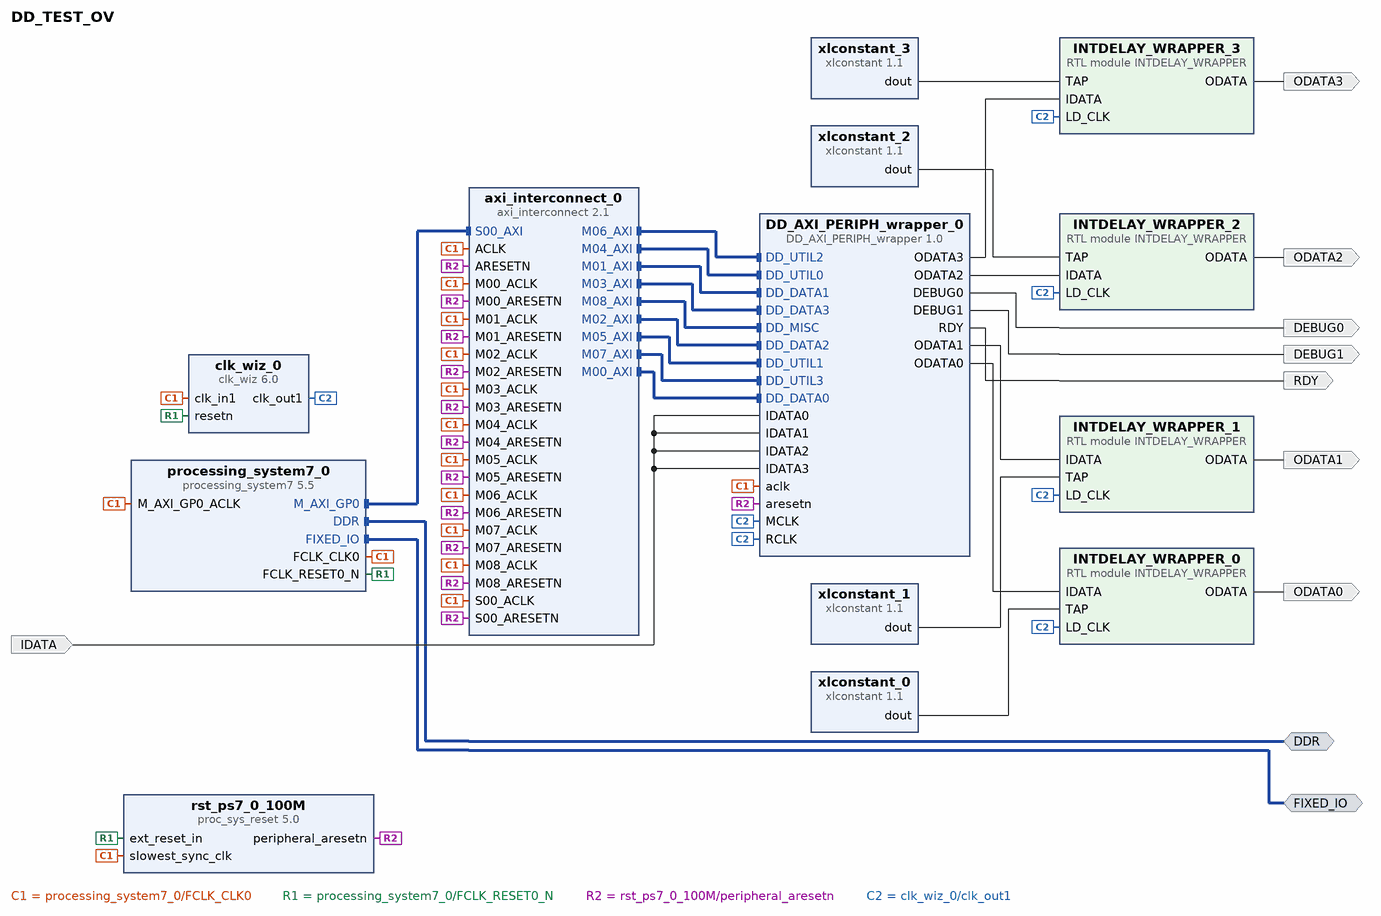
[diagram p0: block diagram of the top level]
# Vivado block design DD_TEST_OV, xc7z020clg400-1, Vivado 2019.1
create_bd_design DD_TEST_OV

create_bd_intf_port -mode Master -vlnv xilinx.com:interface:ddrx_rtl:1.0 DDR
create_bd_intf_port -mode Master -vlnv xilinx.com:display_processing_system7:fixedio_rtl:1.0 FIXED_IO
create_bd_port -dir O ODATA0
create_bd_port -dir O ODATA1
create_bd_port -dir O RDY
create_bd_port -dir I -type data IDATA
create_bd_port -dir O DEBUG0
create_bd_port -dir O DEBUG1
create_bd_port -dir O ODATA2
create_bd_port -dir O ODATA3

create_bd_cell -type ip -vlnv xilinx.com:ip:processing_system7:5.5 processing_system7_0
set_property -dict [list \
  CONFIG.PCW_APU_PERIPHERAL_FREQMHZ 650 \
  CONFIG.PCW_CRYSTAL_PERIPHERAL_FREQMHZ 50 \
  CONFIG.PCW_ENET0_ENET0_IO {MIO 16 .. 27} \
  CONFIG.PCW_ENET0_GRP_MDIO_ENABLE 1 \
  CONFIG.PCW_ENET0_GRP_MDIO_IO {MIO 52 .. 53} \
  CONFIG.PCW_ENET0_PERIPHERAL_ENABLE 1 \
  CONFIG.PCW_ENET0_RESET_ENABLE 1 \
  CONFIG.PCW_ENET0_RESET_IO {MIO 9} \
  CONFIG.PCW_ENET_RESET_ENABLE 1 \
  CONFIG.PCW_ENET_RESET_SELECT {Share reset pin} \
  CONFIG.PCW_FPGA0_PERIPHERAL_FREQMHZ 100 \
  CONFIG.PCW_FPGA1_PERIPHERAL_FREQMHZ 50 \
  CONFIG.PCW_GPIO_MIO_GPIO_ENABLE 1 \
  CONFIG.PCW_GPIO_MIO_GPIO_IO MIO \
  CONFIG.PCW_I2C_RESET_ENABLE 1 \
  CONFIG.PCW_M_AXI_GP0_FREQMHZ 10 \
  CONFIG.PCW_PERIPHERAL_BOARD_PRESET None \
  CONFIG.PCW_PRESET_BANK1_VOLTAGE {LVCMOS 1.8V} \
  CONFIG.PCW_QSPI_GRP_FBCLK_ENABLE 1 \
  CONFIG.PCW_QSPI_GRP_FBCLK_IO {MIO 8} \
  CONFIG.PCW_QSPI_GRP_SINGLE_SS_ENABLE 1 \
  CONFIG.PCW_QSPI_GRP_SINGLE_SS_IO {MIO 1 .. 6} \
  CONFIG.PCW_QSPI_PERIPHERAL_ENABLE 1 \
  CONFIG.PCW_QSPI_QSPI_IO {MIO 1 .. 6} \
  CONFIG.PCW_SD0_GRP_CD_ENABLE 1 \
  CONFIG.PCW_SD0_GRP_CD_IO {MIO 47} \
  CONFIG.PCW_SD0_GRP_WP_ENABLE 0 \
  CONFIG.PCW_SD0_PERIPHERAL_ENABLE 1 \
  CONFIG.PCW_SD0_SD0_IO {MIO 40 .. 45} \
  CONFIG.PCW_SDIO_PERIPHERAL_FREQMHZ 50 \
  CONFIG.PCW_SINGLE_QSPI_DATA_MODE x4 \
  CONFIG.PCW_UART0_PERIPHERAL_ENABLE 1 \
  CONFIG.PCW_UART0_UART0_IO {MIO 14 .. 15} \
  CONFIG.PCW_UART1_PERIPHERAL_ENABLE 0 \
  CONFIG.PCW_UART_PERIPHERAL_FREQMHZ 100 \
  CONFIG.PCW_UIPARAM_DDR_BUS_WIDTH {16 Bit} \
  CONFIG.PCW_UIPARAM_DDR_FREQ_MHZ 525 \
  CONFIG.PCW_UIPARAM_DDR_PARTNO {MT41J256M16 RE-125} \
  CONFIG.PCW_USB0_PERIPHERAL_ENABLE 1 \
  CONFIG.PCW_USB0_RESET_ENABLE 1 \
  CONFIG.PCW_USB0_RESET_IO {MIO 46} \
  CONFIG.PCW_USB0_USB0_IO {MIO 28 .. 39} \
  CONFIG.PCW_USB_RESET_ENABLE 1 \
  CONFIG.PCW_USB_RESET_SELECT {Share reset pin} \
] [get_bd_cells processing_system7_0]
# 481 more settings of processing_system7_0 are not shown: defaults, MIO pin electricals, DDR timing, and values the tool derives
create_bd_cell -type ip -vlnv xilinx.com:ip:axi_interconnect:2.1 axi_interconnect_0
set_property -dict {CONFIG.NUM_MI 9} [get_bd_cells axi_interconnect_0]
create_bd_cell -type ip -vlnv xilinx.com:ip:proc_sys_reset:5.0 rst_ps7_0_100M
create_bd_cell -type ip -vlnv cri.nz:user:DD_AXI_PERIPH_wrapper:1.0 DD_AXI_PERIPH_wrapper_0
create_bd_cell -type ip -vlnv xilinx.com:ip:clk_wiz:6.0 clk_wiz_0
set_property -dict [list \
  CONFIG.CLKOUT1_JITTER 96.239 \
  CONFIG.CLKOUT1_PHASE_ERROR 88.872 \
  CONFIG.CLKOUT1_REQUESTED_OUT_FREQ 310.000 \
  CONFIG.JITTER_SEL Min_O_Jitter \
  CONFIG.MMCM_BANDWIDTH HIGH \
  CONFIG.MMCM_CLKFBOUT_MULT_F 11.625 \
  CONFIG.MMCM_CLKOUT0_DIVIDE_F 3.750 \
  CONFIG.PRIM_IN_FREQ 100.000 \
  CONFIG.RESET_PORT resetn \
  CONFIG.RESET_TYPE ACTIVE_LOW \
  CONFIG.USE_LOCKED false \
] [get_bd_cells clk_wiz_0]
create_bd_cell -type module -reference INTDELAY_WRAPPER INTDELAY_WRAPPER_0
create_bd_cell -type module -reference INTDELAY_WRAPPER INTDELAY_WRAPPER_1
create_bd_cell -type module -reference INTDELAY_WRAPPER INTDELAY_WRAPPER_2
create_bd_cell -type module -reference INTDELAY_WRAPPER INTDELAY_WRAPPER_3
create_bd_cell -type ip -vlnv xilinx.com:ip:xlconstant:1.1 xlconstant_0
set_property -dict {CONFIG.CONST_VAL 1 CONFIG.CONST_WIDTH 5} [get_bd_cells xlconstant_0]
create_bd_cell -type ip -vlnv xilinx.com:ip:xlconstant:1.1 xlconstant_1
set_property -dict {CONFIG.CONST_VAL 0 CONFIG.CONST_WIDTH 5} [get_bd_cells xlconstant_1]
create_bd_cell -type ip -vlnv xilinx.com:ip:xlconstant:1.1 xlconstant_2
set_property -dict {CONFIG.CONST_VAL 19 CONFIG.CONST_WIDTH 5} [get_bd_cells xlconstant_2]
create_bd_cell -type ip -vlnv xilinx.com:ip:xlconstant:1.1 xlconstant_3
set_property -dict {CONFIG.CONST_VAL 0 CONFIG.CONST_WIDTH 5} [get_bd_cells xlconstant_3]

# ---- connections ----

connect_bd_intf_net [get_bd_intf_pins axi_interconnect_0/M06_AXI] [get_bd_intf_pins DD_AXI_PERIPH_wrapper_0/DD_UTIL2]
connect_bd_intf_net [get_bd_intf_pins axi_interconnect_0/M04_AXI] [get_bd_intf_pins DD_AXI_PERIPH_wrapper_0/DD_UTIL0]
connect_bd_intf_net [get_bd_intf_ports DDR] [get_bd_intf_pins processing_system7_0/DDR]
connect_bd_intf_net [get_bd_intf_pins DD_AXI_PERIPH_wrapper_0/DD_DATA1] [get_bd_intf_pins axi_interconnect_0/M01_AXI]
connect_bd_intf_net [get_bd_intf_ports FIXED_IO] [get_bd_intf_pins processing_system7_0/FIXED_IO]
connect_bd_intf_net [get_bd_intf_pins axi_interconnect_0/M03_AXI] [get_bd_intf_pins DD_AXI_PERIPH_wrapper_0/DD_DATA3]
connect_bd_intf_net [get_bd_intf_pins axi_interconnect_0/M08_AXI] [get_bd_intf_pins DD_AXI_PERIPH_wrapper_0/DD_MISC]
connect_bd_intf_net [get_bd_intf_pins axi_interconnect_0/M02_AXI] [get_bd_intf_pins DD_AXI_PERIPH_wrapper_0/DD_DATA2]
connect_bd_intf_net [get_bd_intf_pins axi_interconnect_0/M05_AXI] [get_bd_intf_pins DD_AXI_PERIPH_wrapper_0/DD_UTIL1]
connect_bd_intf_net [get_bd_intf_pins axi_interconnect_0/S00_AXI] [get_bd_intf_pins processing_system7_0/M_AXI_GP0]
connect_bd_intf_net [get_bd_intf_pins axi_interconnect_0/M07_AXI] [get_bd_intf_pins DD_AXI_PERIPH_wrapper_0/DD_UTIL3]
connect_bd_intf_net [get_bd_intf_pins DD_AXI_PERIPH_wrapper_0/DD_DATA0] [get_bd_intf_pins axi_interconnect_0/M00_AXI]
connect_bd_net [get_bd_pins processing_system7_0/FCLK_CLK0] \
  [get_bd_pins axi_interconnect_0/ACLK] [get_bd_pins rst_ps7_0_100M/slowest_sync_clk] \
  [get_bd_pins axi_interconnect_0/M00_ACLK] [get_bd_pins axi_interconnect_0/M01_ACLK] \
  [get_bd_pins axi_interconnect_0/S00_ACLK] [get_bd_pins processing_system7_0/M_AXI_GP0_ACLK] \
  [get_bd_pins axi_interconnect_0/M02_ACLK] [get_bd_pins axi_interconnect_0/M03_ACLK] \
  [get_bd_pins axi_interconnect_0/M04_ACLK] [get_bd_pins axi_interconnect_0/M05_ACLK] \
  [get_bd_pins DD_AXI_PERIPH_wrapper_0/aclk] [get_bd_pins axi_interconnect_0/M06_ACLK] \
  [get_bd_pins axi_interconnect_0/M07_ACLK] [get_bd_pins axi_interconnect_0/M08_ACLK] [get_bd_pins clk_wiz_0/clk_in1]
connect_bd_net [get_bd_pins processing_system7_0/FCLK_RESET0_N] [get_bd_pins rst_ps7_0_100M/ext_reset_in] [get_bd_pins clk_wiz_0/resetn]
connect_bd_net [get_bd_pins rst_ps7_0_100M/peripheral_aresetn] \
  [get_bd_pins axi_interconnect_0/ARESETN] [get_bd_pins axi_interconnect_0/M00_ARESETN] \
  [get_bd_pins axi_interconnect_0/M01_ARESETN] [get_bd_pins axi_interconnect_0/S00_ARESETN] \
  [get_bd_pins axi_interconnect_0/M02_ARESETN] [get_bd_pins axi_interconnect_0/M03_ARESETN] \
  [get_bd_pins axi_interconnect_0/M04_ARESETN] [get_bd_pins axi_interconnect_0/M05_ARESETN] \
  [get_bd_pins DD_AXI_PERIPH_wrapper_0/aresetn] [get_bd_pins axi_interconnect_0/M06_ARESETN] \
  [get_bd_pins axi_interconnect_0/M07_ARESETN] [get_bd_pins axi_interconnect_0/M08_ARESETN]
connect_bd_net [get_bd_ports IDATA] \
  [get_bd_pins DD_AXI_PERIPH_wrapper_0/IDATA0] [get_bd_pins DD_AXI_PERIPH_wrapper_0/IDATA1] \
  [get_bd_pins DD_AXI_PERIPH_wrapper_0/IDATA2] [get_bd_pins DD_AXI_PERIPH_wrapper_0/IDATA3]
connect_bd_net -net clk_wiz_1_clk_out1 [get_bd_pins clk_wiz_0/clk_out1] \
  [get_bd_pins DD_AXI_PERIPH_wrapper_0/RCLK] [get_bd_pins DD_AXI_PERIPH_wrapper_0/MCLK] \
  [get_bd_pins INTDELAY_WRAPPER_0/LD_CLK] [get_bd_pins INTDELAY_WRAPPER_1/LD_CLK] [get_bd_pins INTDELAY_WRAPPER_2/LD_CLK] \
  [get_bd_pins INTDELAY_WRAPPER_3/LD_CLK]
connect_bd_net [get_bd_pins DD_AXI_PERIPH_wrapper_0/RDY] [get_bd_ports RDY]
connect_bd_net [get_bd_pins DD_AXI_PERIPH_wrapper_0/DEBUG0] [get_bd_ports DEBUG0]
connect_bd_net [get_bd_pins DD_AXI_PERIPH_wrapper_0/DEBUG1] [get_bd_ports DEBUG1]
connect_bd_net [get_bd_pins INTDELAY_WRAPPER_0/ODATA] [get_bd_ports ODATA0]
connect_bd_net [get_bd_pins INTDELAY_WRAPPER_1/ODATA] [get_bd_ports ODATA1]
connect_bd_net [get_bd_pins INTDELAY_WRAPPER_2/ODATA] [get_bd_ports ODATA2]
connect_bd_net [get_bd_pins INTDELAY_WRAPPER_3/ODATA] [get_bd_ports ODATA3]
connect_bd_net [get_bd_pins DD_AXI_PERIPH_wrapper_0/ODATA0] [get_bd_pins INTDELAY_WRAPPER_0/IDATA]
connect_bd_net [get_bd_pins DD_AXI_PERIPH_wrapper_0/ODATA1] [get_bd_pins INTDELAY_WRAPPER_1/IDATA]
connect_bd_net [get_bd_pins DD_AXI_PERIPH_wrapper_0/ODATA2] [get_bd_pins INTDELAY_WRAPPER_2/IDATA]
connect_bd_net [get_bd_pins DD_AXI_PERIPH_wrapper_0/ODATA3] [get_bd_pins INTDELAY_WRAPPER_3/IDATA]
connect_bd_net [get_bd_pins xlconstant_0/dout] [get_bd_pins INTDELAY_WRAPPER_0/TAP]
connect_bd_net [get_bd_pins xlconstant_1/dout] [get_bd_pins INTDELAY_WRAPPER_1/TAP]
connect_bd_net [get_bd_pins xlconstant_2/dout] [get_bd_pins INTDELAY_WRAPPER_2/TAP]
connect_bd_net [get_bd_pins xlconstant_3/dout] [get_bd_pins INTDELAY_WRAPPER_3/TAP]

# ---- address map ----
assign_bd_address -offset 0x43C00000 -range 64K -target_address_space [get_bd_addr_spaces processing_system7_0/Data] [get_bd_addr_segs DD_AXI_PERIPH_wrapper_0/DD_DATA0/reg0]
assign_bd_address -offset 0x43C10000 -range 64K -target_address_space [get_bd_addr_spaces processing_system7_0/Data] [get_bd_addr_segs DD_AXI_PERIPH_wrapper_0/DD_DATA1/reg0]
assign_bd_address -offset 0x43C20000 -range 64K -target_address_space [get_bd_addr_spaces processing_system7_0/Data] [get_bd_addr_segs DD_AXI_PERIPH_wrapper_0/DD_DATA2/reg0]
assign_bd_address -offset 0x43C30000 -range 64K -target_address_space [get_bd_addr_spaces processing_system7_0/Data] [get_bd_addr_segs DD_AXI_PERIPH_wrapper_0/DD_DATA3/reg0]
assign_bd_address -offset 0x43C40000 -range 64K -target_address_space [get_bd_addr_spaces processing_system7_0/Data] [get_bd_addr_segs DD_AXI_PERIPH_wrapper_0/DD_UTIL0/reg0]
assign_bd_address -offset 0x43C50000 -range 64K -target_address_space [get_bd_addr_spaces processing_system7_0/Data] [get_bd_addr_segs DD_AXI_PERIPH_wrapper_0/DD_UTIL1/reg0]
assign_bd_address -offset 0x43C60000 -range 64K -target_address_space [get_bd_addr_spaces processing_system7_0/Data] [get_bd_addr_segs DD_AXI_PERIPH_wrapper_0/DD_UTIL2/reg0]
assign_bd_address -offset 0x43C70000 -range 64K -target_address_space [get_bd_addr_spaces processing_system7_0/Data] [get_bd_addr_segs DD_AXI_PERIPH_wrapper_0/DD_UTIL3/reg0]
assign_bd_address -offset 0x43C80000 -range 64K -target_address_space [get_bd_addr_spaces processing_system7_0/Data] [get_bd_addr_segs DD_AXI_PERIPH_wrapper_0/DD_MISC/reg0]

validate_bd_design
save_bd_design
